# EAGLE design IOB-I2C-MCP23017 (EAGLE 7.7.0)
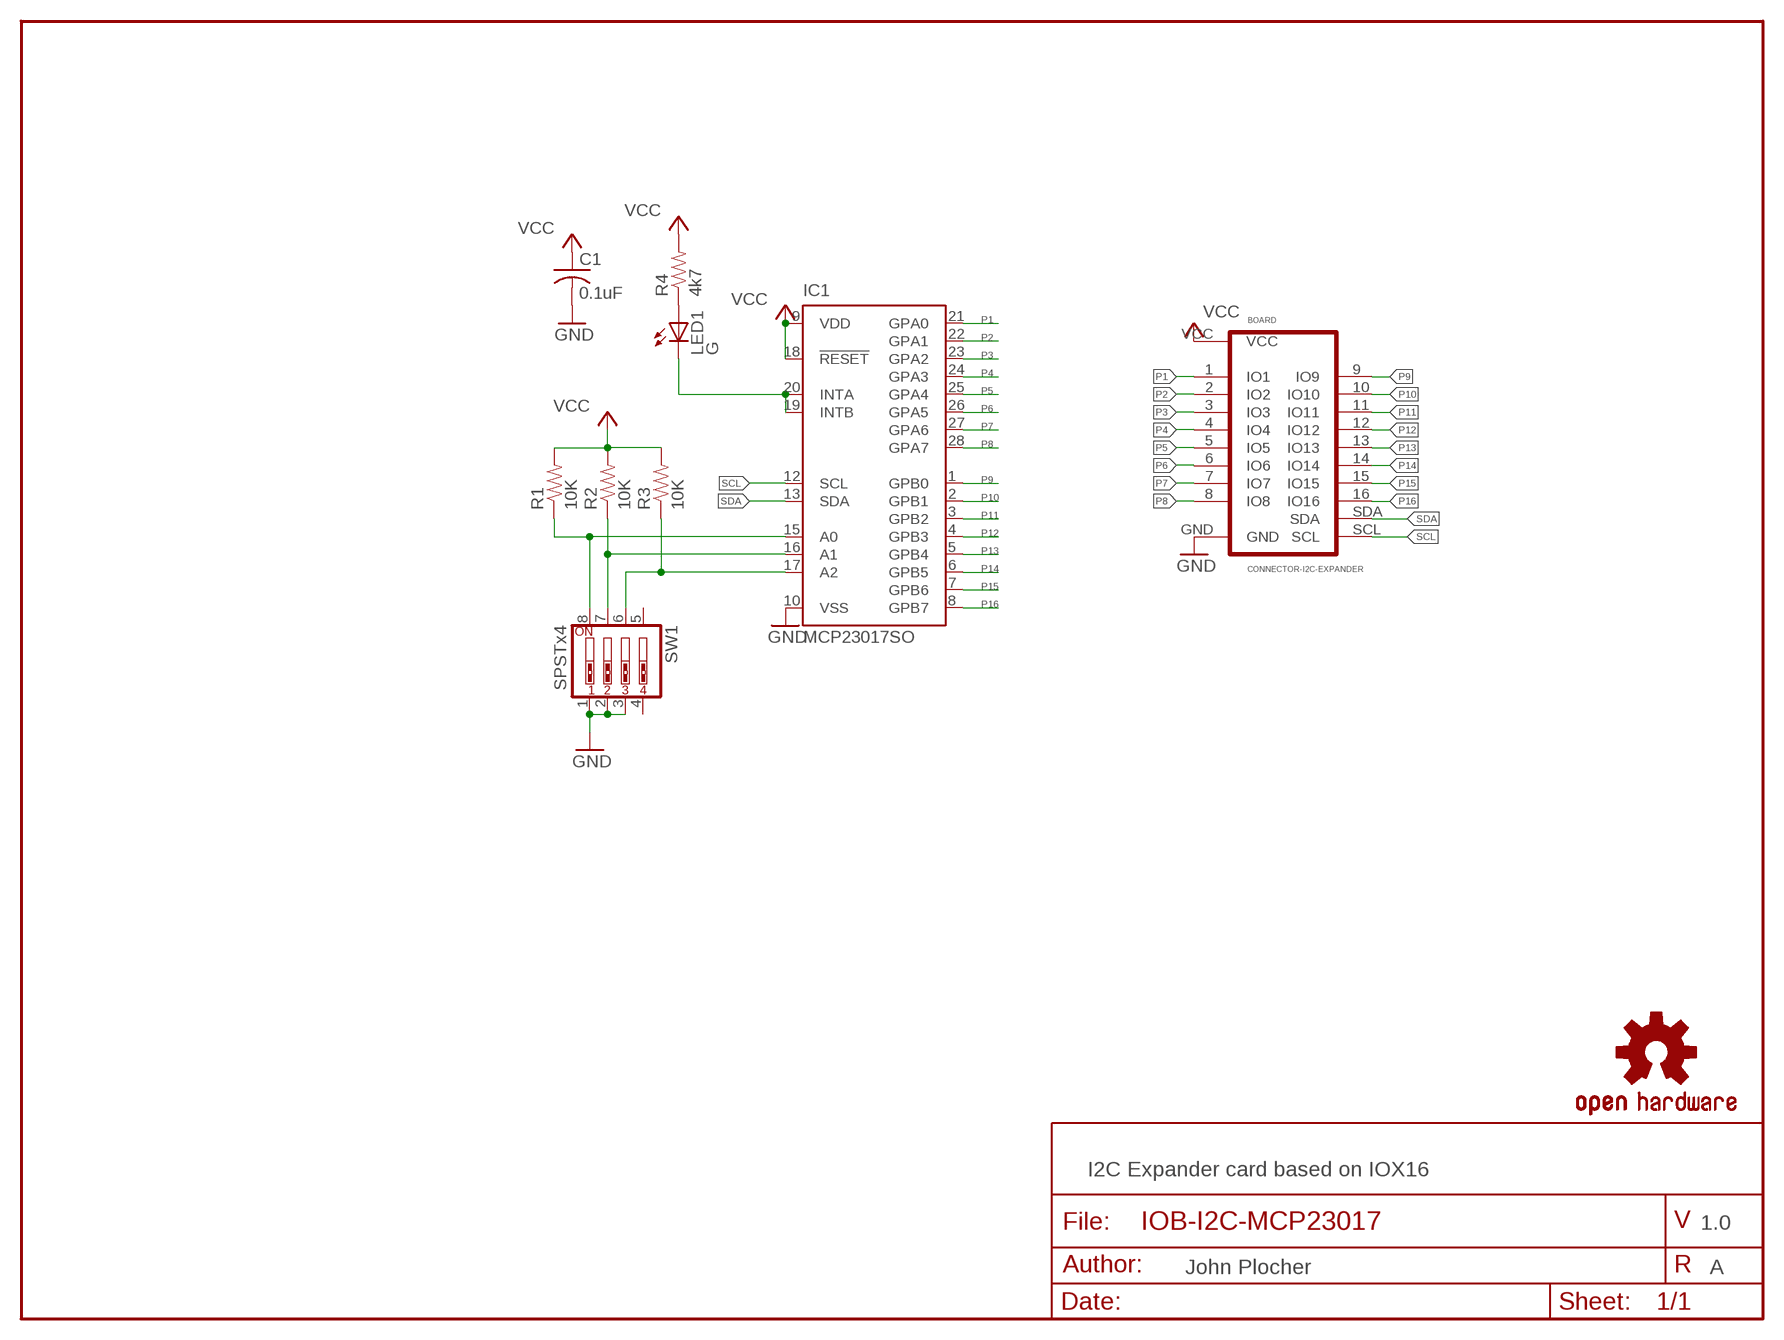
[diagram p0: schematic, sheet 1]

## Parts
BOARD  CONNECTOR-I2C-EXPANDER  [I2C-EXPANDER]
C1  0.1uF  CAP0603  [0603-CAP]
IC1  MCP23017SO  [SO28W]
LED1  G  LED0603-LED  [0603-LED]
OSHW1  OSHW  DOC-OSHW-LOGO-M  [OSHW-LOGO-M]
R1  10K  R0603-RES  [0603-RES]
R2  10K  R0603-RES  [0603-RES]
R3  10K  R0603-RES  [0603-RES]
R4  4k7  R0603-RES  [0603-RES]
SW1  SPSTx4  SW_DIP-4  [EDG-04]

## Nets
A0: IC1.15(A0) R1.1 SW1.8
A1: IC1.16(A1) R2.1 SW1.7
A3: IC1.17(A2) R3.1 SW1.6
GND: BOARD.GND C1.2 IC1.10(VSS) SW1.1 SW1.2 SW1.3
N$1: LED1.A R4.1
N$2: IC1.19(INTB) IC1.20(INTA) LED1.C
P1 [signals]: BOARD.1(IO1) IC1.21(GPA0)
P2 [signals]: BOARD.2(IO2) IC1.22(GPA1)
P3 [signals]: BOARD.3(IO3) IC1.23(GPA2)
P4 [signals]: BOARD.4(IO4) IC1.24(GPA3)
P5: BOARD.5(IO5) IC1.25(GPA4)
P6: BOARD.6(IO6) IC1.26(GPA5)
P7: BOARD.7(IO7) IC1.27(GPA6)
P8: BOARD.8(IO8) IC1.28(GPA7)
P9 [signals]: BOARD.9(IO9) IC1.1(GPB0)
P10 [signals]: BOARD.10(IO10) IC1.2(GPB1)
P11 [signals]: BOARD.11(IO11) IC1.3(GPB2)
P12 [signals]: BOARD.12(IO12) IC1.4(GPB3)
P13 [signals]: BOARD.13(IO13) IC1.5(GPB4)
P14 [signals]: BOARD.14(IO14) IC1.6(GPB5)
P15 [signals]: BOARD.15(IO15) IC1.7(GPB6)
P16 [signals]: BOARD.16(IO16) IC1.8(GPB7)
SCL [signals]: BOARD.SCL IC1.12(SCL)
SDA [signals]: BOARD.SDA IC1.13(SDA)
VCC [Power]: BOARD.VCC C1.1 IC1.9(VDD) IC1.18(!RESET) R1.2 R2.2 R3.2 R4.2
Unconnected: SW1.4 SW1.5

## Notes on the sheet
- I2C Expander card based on IOX16
- 1.0
- John Plocher | A

## Library data of the parts
BOARD = SPCoast:CONNECTOR-I2C-EXPANDER
C1 = SPCoast:CAP*
IC1 = microchip:MCP23017: http://ww1.microchip.com/downloads/en/DeviceDoc/21952a.pdf Source: http://ww1.microchip.com/downloads/en/DeviceDoc/21952a.pdf; MF: MICROCHIP; MPN: MCP23017-E/SO; OC_FARNELL: 1332087; OC_NEWARK: 31K2958
LED1 = SPCoast:LED*
OSHW1 = SPCoast:DOC-OSHW-LOGO-: Open Source Hardware Logo This logo indicates the piece of hardware it is found on incorporates a OSHW license and/or adheres to the definition of open source hardware http://freedomdefined.org/OSHW Creative Commons - Attribution - ShareAlike 3.0
R1-R4 = SPCoast:R*: Resistor Basic schematic elements and footprints for 0603, 1206, and PTH 1/10th watt (small) resistors.
SW1 = SPCoast:SW_DIP-4: DIP SWITCH

## Net classes
0 default: width 0.254 mm, drill 0.4 mm, clearance 0.127 mm
1 Power: width 0.254 mm, drill 0.4 mm, clearance 0.127 mm
2 signals: width 0.254 mm, drill 0.4 mm, clearance 0.127 mm

## Board
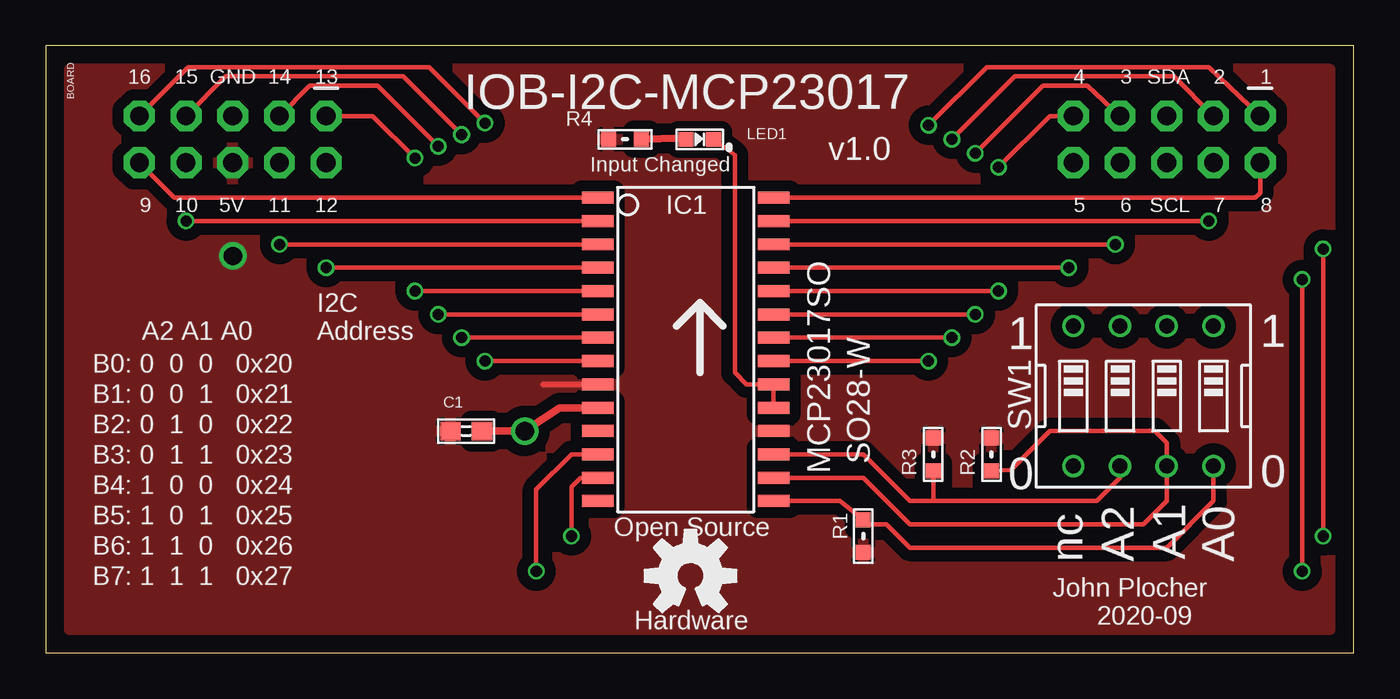
[diagram p1: board, top side]
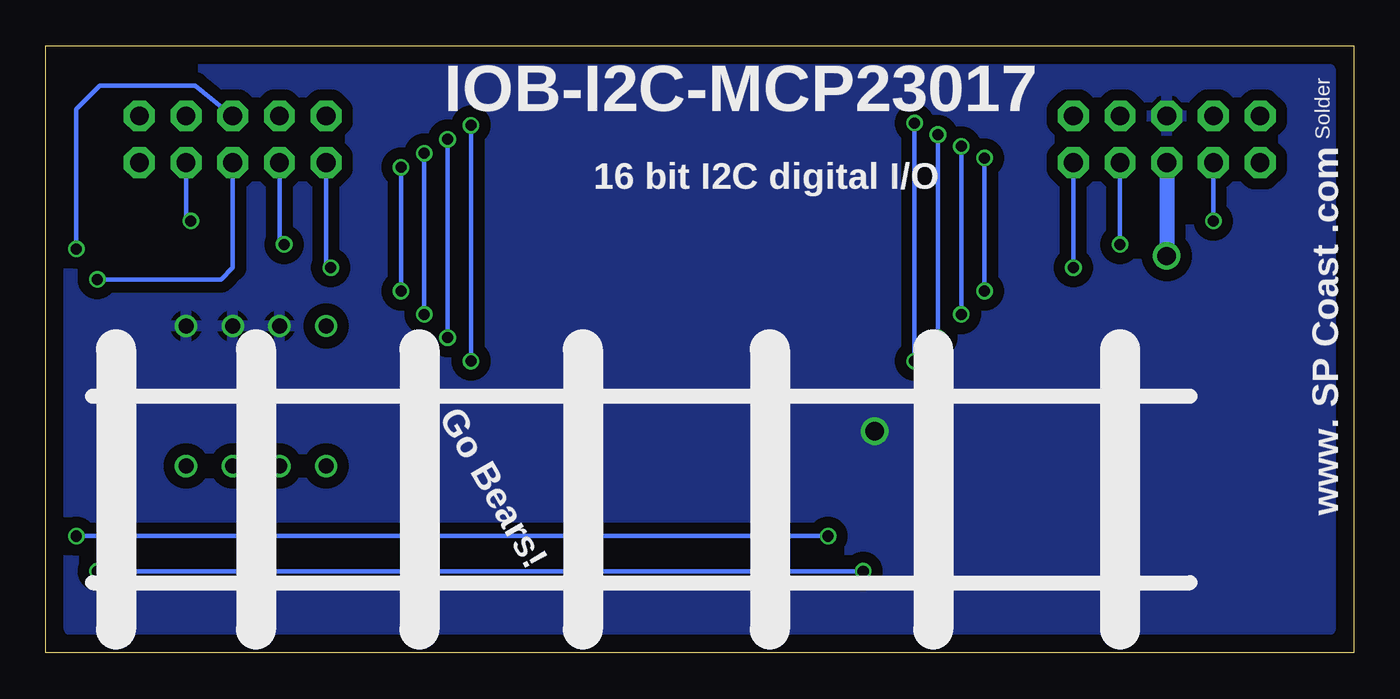
[diagram p2: board, bottom side, seen from below]

Size 71.12 x 33.02 mm. Coordinates in mm from the lower left corner, seen from the top.
Outline: 0,33.02 0,0 71.12,0 71.12,33.02 0,33.02
Copper layers (1*16): Top 0.035mm / dielectric 1.5mm / Bottom 0.035mm
Design rules "default *": minimum track width 5mil, minimum drill 0.2mm, track to track 5mil, track to pad 5mil, pad to pad 5mil, via to via 5mil, smd to smd 5mil, copper to edge 0.4mm, drill to drill 5mil, minimum pad ring 3mil, minimum via ring 3mil, stop-mask expansion 4mil, vias tented up to drill 0mil, thermal gap 10mil

### Footprints (pad centres in the part's own frame; a part is rotated, then mirrored left to right if it is on the bottom)
I2C-EXPANDER = drill 1.016 pad 1.676 octagon: 1 30.48,1.27; 2 27.94,1.27; 3 22.86,1.27; 4 20.32,1.27; 5 20.32,-1.27; 6 22.86,-1.27; 7 27.94,-1.27; 8 30.48,-1.27; 9 -30.48,-1.27; 10 -27.94,-1.27; 11 -22.86,-1.27; 12 -20.32,-1.27; 13 -20.32,1.27; 14 -22.86,1.27; 15 -27.94,1.27; 16 -30.48,1.27; GND -25.4,1.27; SCL 25.4,-1.27; SDA 25.4,1.27; VCC -25.4,-1.27
0603-CAP = smd 1.1 x 1: 1 -0.85,0; 2 0.85,0
SO28W = smd 0.65 x 1.7: 1 -7.62,-4.78; 2 -6.35,-4.78; 3 -5.08,-4.78; 4 -3.81,-4.78; 5 -2.54,-4.78; 6 -1.27,-4.78; 7 0,-4.78; 8 1.27,-4.78; 9 2.54,-4.78; 10 3.81,-4.78; 11 5.08,-4.78; 12 6.35,-4.78; 13 7.62,-4.78; 14 8.89,-4.78; 15 8.89,4.78; 16 7.62,4.78; 17 6.35,4.78; 18 5.08,4.78; 19 3.81,4.78; 20 2.54,4.78; 21 1.27,4.78; 22 0,4.78; 23 -1.27,4.78; 24 -2.54,4.78; 25 -3.81,4.78; 26 -5.08,4.78; 27 -6.35,4.78; 28 -7.62,4.78
0603-LED = smd 0.8 x 0.8: A 0.75,0; C -0.75,0
0603-RES = smd 0.813 x 0.813: 1 -0.889,0; 2 0.889,0
EDG-04 = drill 0.813: 1 -3.81,-3.81; 2 -1.27,-3.81; 3 1.27,-3.81; 4 3.81,-3.81; 5 3.81,3.81; 6 1.27,3.81; 7 -1.27,3.81; 8 -3.81,3.81

### Placement (x,y rotation side)
BOARD  35.56,27.94 0 top
C1  22.86,12.06 0 top
IC1  34.8,17.14 270 top
LED1  35.56,27.94 180 top
OSHW1  35.05,4.19 0 top
R1  44.45,6.35 270 top
R2  51.44,10.79 90 top
R3  48.26,10.79 90 top
R4  31.5,27.94 180 top
SW1  59.69,13.97 180 top

### Tracks (layer width: path | path; a pad name or v marks a point on that pad's centre or on a via)
A0
  Top 0.254: IC1.15 43.18,8.26 R1.1 44.66,6.99 45.72,6.99 46.99,5.71 60.96,5.71 63.5,8.26 SW1.8
A1
  Top 0.254: IC1.16 44.45,9.53 46.99,6.99 59.69,6.99 60.96,8.26 SW1.7 60.96,11.43 60.33,12.06 54.61,12.06 52.49,9.95 R2.1
A3
  Top 0.254: IC1.17 44.45,10.79 46.99,8.26 48.26,8.26 | 48.26,8.26 57.15,8.26 58.42,9.53 SW1.6 | R3.1 48.26,8.26
GND  (via drill 1)
  Top 0.406: IC1.10 27.94,13.34 v26.04,12.06 C1.2
  pour Bottom (isolate 0.61): 1.27,31.75 1.27,1.27 69.85,1.27 69.85,31.75
N$1
  Top 0.406: LED1.A 34.51,27.99 R4.1
N$2
  Top 0.254: IC1.19 IC1.20 38.1,14.61 37.47,15.24 37.47,27.09 LED1.C
P1  (via drill 0.6)
  Top 0.254: IC1.21 v48.01,15.88 | BOARD.1 63.25,31.88 51.18,31.88 v48.01,28.7
  Bottom 0.254: v48.01,28.7 v48.01,15.88
P2  (via drill 0.6)
  Top 0.254: IC1.22 v49.28,17.14 | BOARD.2 61.34,31.37 52.7,31.37 v49.28,27.94
  Bottom 0.254: v49.28,27.94 v49.28,17.14
P3  (via drill 0.6)
  Top 0.254: IC1.23 v50.55,18.41 | BOARD.3 56.64,30.86 54.23,30.86 v50.55,27.18
  Bottom 0.254: v50.55,27.18 v50.55,18.41
P4  (via drill 0.6)
  Top 0.254: IC1.24 v51.82,19.68 | BOARD.4 54.61,29.21 v51.82,26.42
  Bottom 0.254: v51.82,26.42 v51.82,19.68
P5  (via drill 0.6)
  Top 0.254: IC1.25 v55.63,20.95
  Bottom 0.254: v55.63,20.95 55.88,21.21 BOARD.5
P6  (via drill 0.6)
  Top 0.254: IC1.26 v58.17,22.23
  Bottom 0.254: v58.17,22.23 58.42,22.48 BOARD.6
P7  (via drill 0.6)
  Top 0.254: IC1.27 v63.25,23.5
  Bottom 0.254: v63.25,23.5 63.5,23.75 BOARD.7
P8
  Top 0.254: IC1.28 65.79,24.77 66.04,25.02 BOARD.8
P9
  Top 0.254: IC1.1 6.99,24.77 BOARD.9
P10  (via drill 0.6)
  Top 0.254: v7.62,23.5 IC1.2
  Bottom 0.254: v7.62,23.5 BOARD.10
P11  (via drill 0.6)
  Top 0.254: v12.7,22.23 IC1.3
  Bottom 0.254: v12.7,22.23 BOARD.11
P12  (via drill 0.6)
  Top 0.254: v15.24,20.95 IC1.4
  Bottom 0.254: v15.24,20.95 BOARD.12
P13  (via drill 0.6)
  Top 0.254: v20.07,19.68 IC1.5 | BOARD.13 17.78,29.21 v20.07,26.92
  Bottom 0.254: v20.07,26.92 v20.07,19.68
P14  (via drill 0.6)
  Top 0.254: v21.34,18.41 IC1.6 | BOARD.14 14.35,30.86 18.03,30.86 v21.34,27.56
  Bottom 0.254: v21.34,27.56 v21.34,18.41
P15  (via drill 0.6)
  Top 0.254: v22.61,17.14 IC1.7 | BOARD.15 9.78,31.37 19.43,31.37 v22.61,28.19
  Bottom 0.254: v22.61,28.19 v22.61,17.14
P16  (via drill 0.6)
  Top 0.254: v23.88,15.88 IC1.8 | BOARD.16 7.75,31.88 20.83,31.88 v23.88,28.83
  Bottom 0.254: v23.88,28.83 v23.88,15.88
SCL  (via drill 0.6)
  Top 0.254: v68.33,20.32 v68.33,4.45 | v26.67,4.45 26.67,8.89 28.57,10.79 IC1.12
  Bottom 0.254: BOARD.SCL 60.96,20.95 61.59,20.32 v68.33,20.32 | v68.33,4.45 v26.67,4.45
SDA  (via drill 0.6)
  Top 0.254: v69.47,21.97 v69.47,6.35 | v28.57,6.35 28.57,9.02 29.08,9.53 IC1.13
  Bottom 0.254: BOARD.SDA 62.99,30.86 68.2,30.86 69.47,29.59 v69.47,21.97 | v69.47,6.35 v28.57,6.35
VCC  (via drill 1)
  Top 0.305: 27.04,14.61 IC1.9
  Bottom 0.813: BOARD.VCC v10.16,21.59
  pour Top (isolate 0.61, rank 3): 1.27,31.75 1.27,1.27 69.85,1.27 69.85,31.75

### Text on the board
tPlace: v1.0 | Input Changed | A2 A1 A0 | I2C / Address | 1 | 1 | B0: 0 0 0 0x20 | B1: 0 0 1 0x21 | B2: 0 1 0 0x22 | B3: 0 1 1 0x23 | MCP23017SO | SO28-W | B4: 1 0 0 0x24 | 0 | 0 | B5: 1 0 1 0x25 | Open Source | B6: 1 1 0 0x26 | nc | A2 | A1 | A0 | B7: 1 1 1 0x27 | John Plocher | 2020-09 | Hardware
bPlace: www. SP Coast .com | 16 bit I2C digital I/O | Go Bears!
bNames: Solder
_tNames: BOARD | R4 | LED1 | IC1 | SW1 | C1 | R3 | R2 | R1